# Altium schematic sheet Thietkehethongnhung.SchDoc
size A; SheetNumber: 1; SheetTotal: 1
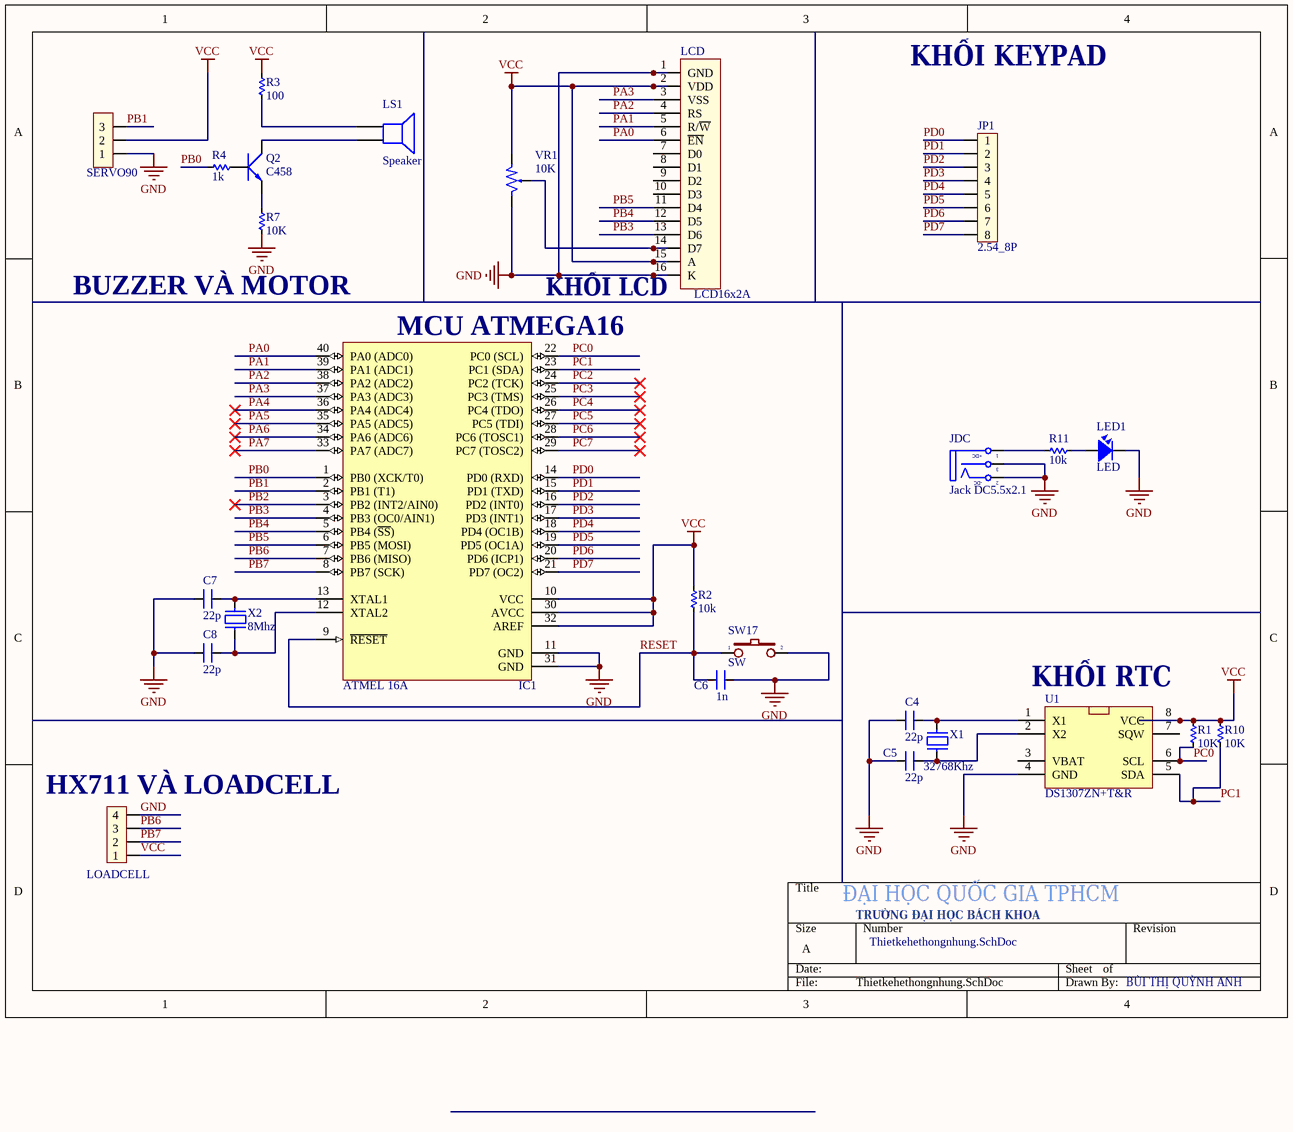
[diagram p0: Thietkehethongnhung.SchDoc]

## Parts
C4  22p  [CN1.5]
C5  22p  [CN1.5]
C6  1n  [CN1.5]
C7  22p  [CN1.5]
C8  22p  [CN1.5]
IC1  ATMEL 16A  [DIP40/W0.6]
J2  LOADCELL  [JP4]
JDC  Jack DC5.5x2.1  [DC-IN]
JP1  2.54_8P  [JP8]
LCD  LCD16x2A  [LCD16X2]
LED1  LED  [LED-3]
LS1  Speaker  [SPEAKER]
P1  SERVO90  [JP3]
Q2  C458  [TO92-123]
R1  10K  [RES-1/2W]
R2  10k  [RES-1/2W]
R3  100  [RES-1/2W]
R4  1k  [RES-1/2W]
R7  10K  [RES-1/2W]
R10  10K  [RES-1/2W]
R11  10k  [RES-1/2W]
SW17  SW  [SW-RST]
U1  DS1307ZN+T&R  [DIP794W47P254L991H457Q8]
VR1  10K  [VR]
X1  32768Khz  [XT2]
X2  8Mhz  [XT2]

## Nets
GND: C4.1 C5.1 C6.2 C7.1 C8.1 IC1.11(GND) IC1.31(GND) J2.4 JDC.2(TN) JDC.3(S) LCD.1(GND) LCD.16(K) LED1.2 P1.1 R7.2 SW17.2 U1.4(GND) VR1.3
VCC: IC1.10(VCC) IC1.30(AVCC) IC1.32(AREF) J2.1 LCD.2(VDD) LCD.15(A) P1.2 R1.1 R2.1 R3.2 R10.1 U1.8(VCC) VR1.1
PA0: IC1.40(PA0_(ADC0)) LCD.6(~{EN})
PA1: IC1.39(PA1_(ADC1)) LCD.5(R/~{W})
PA2: IC1.38(PA2_(ADC2)) LCD.4(RS)
PA3: IC1.37(PA3_(ADC3)) LCD.3(VSS)
PA4: IC1.36(PA4_(ADC4))
PA5: IC1.35(PA5_(ADC5))
PA6: IC1.34(PA6_(ADC6))
PA7: IC1.33(PA7_(ADC7))
PB0: IC1.1(PB0_(XCK/T0)) R4.2
PB1: IC1.2(PB1_(T1)) P1.3
PB2: IC1.3(PB2_(INT2/AIN0))
PB3: IC1.4(PB3_(OC0/AIN1)) LCD.13(D6)
PB4: IC1.5(PB4_(~{SS})) LCD.12(D5)
PB5: IC1.6(PB5_(MOSI)) LCD.11(D4)
PB6: IC1.7(PB6_(MISO)) J2.3
PB7: IC1.8(PB7_(SCK)) J2.2
PC0: IC1.22(PC0_(SCL)) R1.2 U1.6(SCL)
PC1: IC1.23(PC1_(SDA)) R10.2 U1.5(SDA)
PC2: IC1.24(PC2_(TCK))
PC3: IC1.25(PC3_(TMS))
PC4: IC1.26(PC4_(TDO))
PC5: IC1.27(PC5_(TDI))
PC6: IC1.28(PC6_(TOSC1))
PC7: IC1.29(PC7_(TOSC2))
PD0: IC1.14(PD0_(RXD)) JP1.1
PD1: IC1.15(PD1_(TXD)) JP1.2
PD2: IC1.16(PD2_(INT0)) JP1.3
PD3: IC1.17(PD3_(INT1)) JP1.4
PD4: IC1.18(PD4_(OC1B)) JP1.5
PD5: IC1.19(PD5_(OC1A)) JP1.6
PD6: IC1.20(PD6_(ICP1)) JP1.7
PD7: IC1.21(PD7_(OC2)) JP1.8
RESET: C6.1 IC1.9(~{RESET}) R2.2 SW17.1
NetC4_2: C4.2 U1.1(X1) X1.2
NetC5_2: C5.2 U1.2(X2) X1.1
NetC7_2: C7.2 IC1.13(XTAL1) X2.2
NetC8_2: C8.2 IC1.12(XTAL2) X2.1
NetJDC_1: JDC.1(T) R11.1
NetLCD_14: LCD.14(D7) VR1.2
NetLED1_1: LED1.1 R11.2
NetLS1_1: LS1.1 R3.1
NetLS1_2: LS1.2 Q2.2(C)
NetQ2_1: Q2.1(E) R7.1
NetQ2_3: Q2.3(B) R4.1

Not connected (* = marked no-connect by the designer): LCD 7(D0) 8(D1) 9(D2) 10(D3); U1 3(VBAT) 7(SQW)

## Notes on the sheet
- KHỐI KEYPAD
- (near R7) BUZZER VÀ MOTOR
- KHỐI LCD
- (near IC1) MCU ATMEGA16
- (near U1) KHỐI RTC
- (near J2) HX711 VÀ LOADCELL
- ĐẠI HỌC QUỐC GIA TPHCM
- TRƯỜNG ĐẠI HỌC BÁCH KHOA
- BÙI THỊ QUỲNH ANH
- (in symbol Jac_DC) +DC; -DC

## Library data of the parts
C4-C8 = CN1.5: Cap np 682pF => 104pF; Value: 0.01uF
IC1 = ATmega16A-PU: 8-Bit AVR Microcontroller with 16K Bytes of In-System Programmable Flash Memory; Value: Atmega 16L
J2 = Jum Don Duc 2.54_4P: Cắm; Don_Vi: Con; Ma_Hang: MH000903; Value: Jump Đơn Đực 2.54MM 1x40P Thẳng 11MM; Ghi Chu: *; Kieu Chan: *; Chung_Loai: Cắm
JDC = Jac_DC: Cắm; Ten_Linh_Kien: Jack DC5.5x2.1MM DC5501; Ma_Hang: MH000923; Don_Vi: Con; Kieu_Chan: *; Ghi_Chu: *; Chung_Loai: Cắm
JP1 = Jum Don Duc 2.54_8P: Cắm; Value: Jump Đơn Đực 2.54MM 1x40P Thẳng 11MM; Ma_Hang: MH000903; Don_Vi: Con; Ghi_Chu: *; Kieu Chan: *; Chung_Loai: Cắm
LCD = LCD16x2: LCD dipslay 16 char, 2 line; Value: LCD16x2A
LED1 = LED: LED Single colour Green and Red; Value: LED 3 ly Single Colour
LS1 = Speaker: Loudspeaker; Published: 24-Mar-1999; LatestRevisionDate: 17-Jul-2002; LatestRevisionNote: Re-released for DXP Platform.; PackageReference: PIN2; Publisher: Altium Limited
P1 = Jum Don Duc 2.54_3P: Cắm; Ten_Linh_Kien: Jump Đơn Đực 2.54MM 1x40P Thẳng 11MM; Ma_Hang: MH000903; Don_Vi: Con; Kieu_Chan: *; Ghi_Chu: *; Chung_Loai: Cắm
Q2 = C458: NPN 600mW, ECB; Value: C1815
R1-R4 R7 R10 R11 = Res: Manufacturer: Generic Components; Class: Passive; SubClass: R; Published: 08/06/2000; Publisher: Altium Hobart Technology Centre
SW17 = SW2: Switch button 2 pin; Value: SW chip 2 pin
U1 = DS1307ZN+T&R: IC RTC CLK/CALENDAR I2C 8-SOIC; Manufacturer: Maxim Integrated; Memory Size: 56B; Time Format: HH:MM:SS (12/24 hr); Date Format: YY-MM-DD-dd; Interface: I²C, 2-Wire Serial; Voltage - Supply: 4.5 V ~ 5.5 V; Voltage - Supply, Battery: 2 V ~ 3.5 V; Current - Timekeeping (Max): 200µA @ 5V; Supplier 1: Digi-Key; Manufacturer Part Number: DS1307ZN+T&R; RoHS: RoHS Compliant; Category: Integrated Circuits (ICs); Stock 1: 8457; Pricing 1: 1=3.6, 10=3.392, 25=2.7132, 50=2.5776, 100=2.3741, 250=2.25196, 500=2.17056 (USD); Packaging: Digi-Reel®; Part Status: Active; Type: Clock/Calendar; Features: Leap Year, NVSRAM, Square Wave Output; Operating Temperature: -40°C ~ 85°C; Mounting Type: Surface Mount; Package / Case: 8-SOIC (0.154", 3.90mm Width); Supplier Device Package: 8-SOIC; Base Part Number: DS1307; ComponentLink1URL: http://datasheets.maximintegrated.com/en/ds/DS1307.pdf; ComponentLink1Description: http://datasheets.maximintegrated.com/en/ds/DS1307.pdf; Supplier Part Number 1: DS1307ZN+T&RDKR-ND
VR1 = VR1: Var Resistor; Value: VR 10K
X1 X2 = XT2: Crystal, 32.768 KHz, -40 to 85 degC, 3.2 x 1.5 x 0.9 mm SMD; Value: 4Mhz